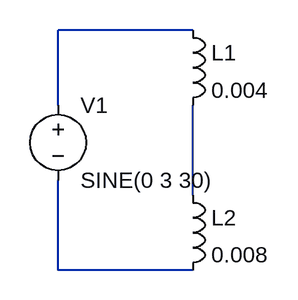
[diagram p0: schematic 2indseries.asc]
2indseries.asc, the LTspice schematic file:
Version 4
SHEET 1 880 680
WIRE 240 48 96 48
WIRE 96 128 96 48
WIRE 240 224 240 128
WIRE 96 304 96 208
WIRE 240 304 96 304
SYMBOL voltage 96 112 R0
WINDOW 123 0 0 Left 0
WINDOW 39 0 0 Left 0
SYMATTR InstName V1
SYMATTR Value SINE(0 3 30)
SYMBOL ind 224 32 R0
SYMATTR InstName L1
SYMATTR Value 0.004
SYMBOL ind 224 208 R0
SYMATTR InstName L2
SYMATTR Value 0.008

The netlist it stands for:
* 2indseries.asc
V1 N001 N003 SINE(0 3 30)
L1 N001 N002 0.004
L2 N002 N003 0.008
.backanno
.end